# EAGLE design SMSM (EAGLE 7.3.0)
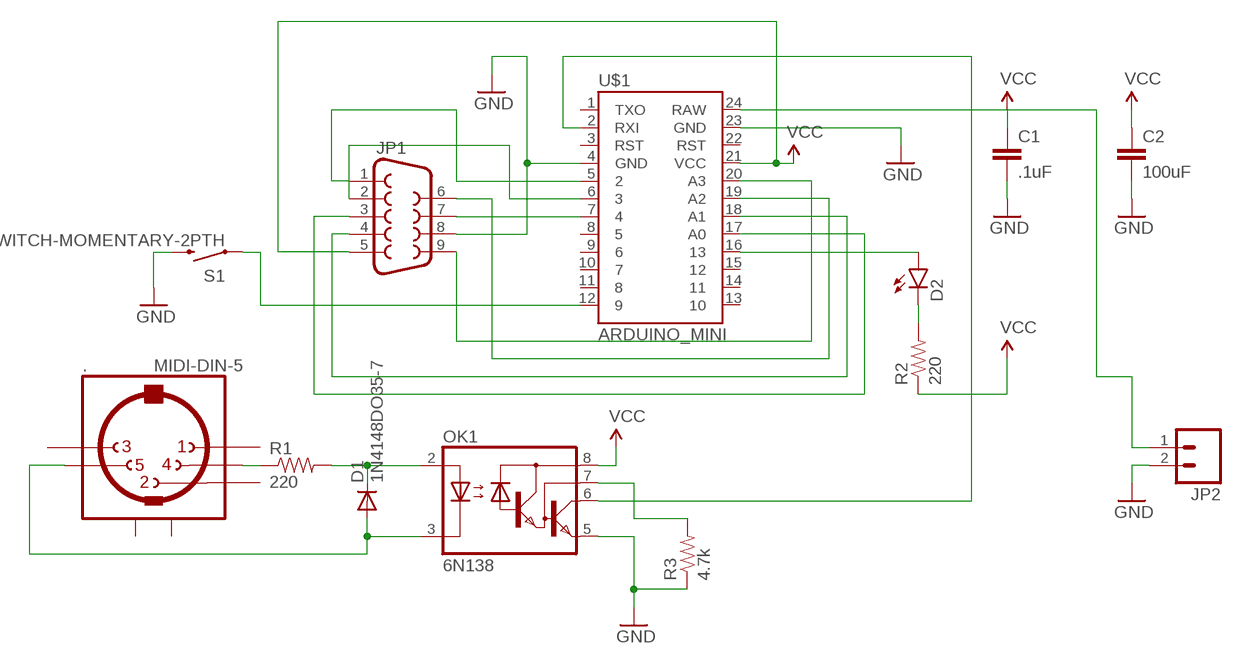
[diagram p0: schematic, sheet 1]

## Parts
.  MIDI-DIN-5  [MIDI-DIN-5]
C1  .1uF  CAPKIT  [CAP-PTH-SMALL-KIT]
C2  100uF  CAPKIT  [CAP-PTH-SMALL-KIT]
D1  1N4148DO35-7  [DO35-7]
D2  LED3MM  [LED3MM]
JP1  DB9FEMALE  [DB9]
JP2  M02LOCK_LONGPADS  [1X02_LOCK_LONGPADS]
OK1  6N138  [DIL08]
R1  220  10KOHM-1/4W5%(PTH)  [AXIAL-0.3]
R2  220  10KOHM-1/4W5%(PTH)  [AXIAL-0.3]
R3  4.7k  10KOHM-1/4W5%(PTH)  [AXIAL-0.3]
S1  SWITCH-MOMENTARY-2PTH  [TACTILE-PTH]
U$1  ARDUINO_MINI  [ARDUINO_MINI]

## Nets
GND: C1.2 C2.2 JP1.8 JP2.2 OK1.5(GND) R3.P$1 S1.3 U$1.4(GND) U$1.23(GND)
N$1: JP1.1 U$1.5
N$2: JP1.2 U$1.6
N$3: JP1.7 U$1.7
N$4: D2.A U$1.16
N$5: JP1.3 U$1.17(A0)
N$6: JP1.4 U$1.18(A1)
N$7: JP1.6 U$1.19(A2)
N$8: JP1.9 U$1.20(A3)
N$9: ..5 D1.A OK1.3(C)
N$10: D1.C OK1.2(A) R1.P$2
N$11: D2.K(C) R2.P$2
N$12: ..4 R1.P$1
N$13: OK1.7(VB) R3.P$2
N$14: OK1.6(VO) U$1.2(RXI)
N$15: S1.1 U$1.12
N$16: JP2.1 U$1.24(RAW)
VCC: C1.1 C2.1 JP1.5 OK1.8(VCC) R2.P$1 U$1.21(VCC)
Unconnected: ..1 ..2 ..3 ..PE1 ..PE2 ..PE11(PE1) ..PE22(PE2) U$1.1(TXO) U$1.3(RST) U$1.8 U$1.9 U$1.10 U$1.11 U$1.13 U$1.14 U$1.15 U$1.22(RST)

## Library data of the parts
. = MIDI by Jazz:MIDI-DIN-5
C1 C2 = SparkFun-Capacitors:CAP: Capacitor Standard 0603 ceramic capacitor, and 0.1" leaded capacitor.
D1 = diode:1N4148: DIODE high speed (Philips)
D2 = SparkFun-LED:LED: LEDs Standard schematic elements and footprints for 5mm, 3mm, 1206, and 0603 sized LEDs. 5mm - Spark Fun Electronics SKU : COM-00529 (and others)
JP1 = SparkFun-Connectors:DB9: DB9 Connector Standard DB9 (D-Sub 9) serial connector. Can be used for CAN bus as well as RS485 and RS232. Footprint production proven. Spark Fun Electronics SKU : PRT-00429; PROD_ID: CONN-08194
JP2 = SparkFun-Connectors:M02: Standard 2-pin 0.1" header. Use with - straight break away headers ( PRT-00116) - right angle break away headers (PRT-00553) - swiss pins (PRT-00743) - machine pins (PRT-00117) - female headers (PRT-00115) Molex polarized connector foot print use with: PRT-08233 with associated crimp pins and housings. 2.54_SCREWTERM for use with PRT-10571. 3.5mm Screw Terminal footprints for PRT-08084 5mm Screw Terminal footprints for use with PRT-08432
OK1 = optocoupler:6N138: MOTOROLA OPTO COUPLER; MF: VISHAY/TELEFUNKEN; MPN: 6N138; OC_FARNELL: 9860150; OC_NEWARK: 35K5294
R1-R3 = SparkFun-Resistors:10KOHM-1/4W5%(PTH): RES-09435; PROD_ID: RES-9435; VALUE: 10k
S1 = SparkFun-Electromechanical:SWITCH-MOMENTARY-2: Various NO switches- pushbuttons, reed, etc; PROD_ID: SWCH-08441
U$1 = SparkFun-Boards:ARDUINO_MINI: Arduino Pro Mini footprint

## Board
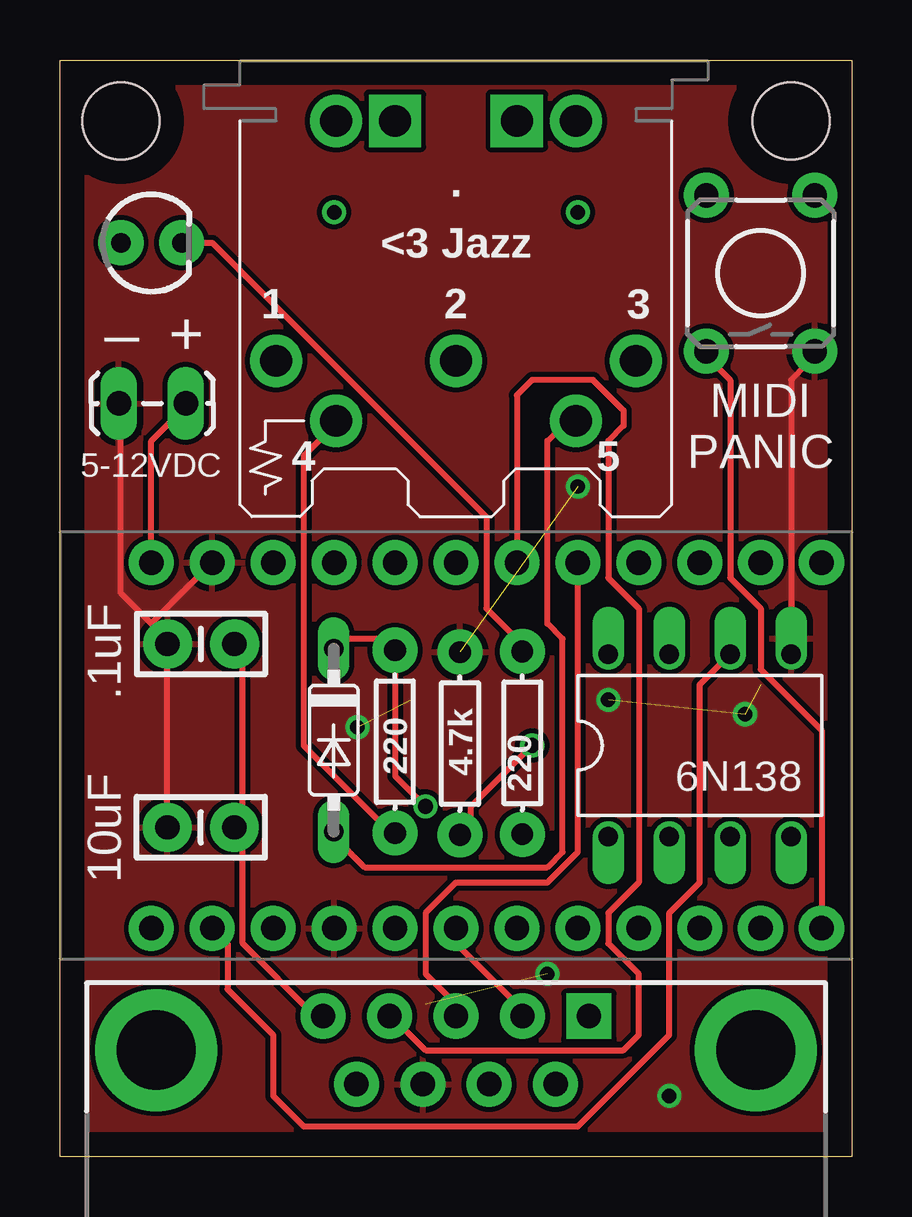
[diagram p1: board, top side]
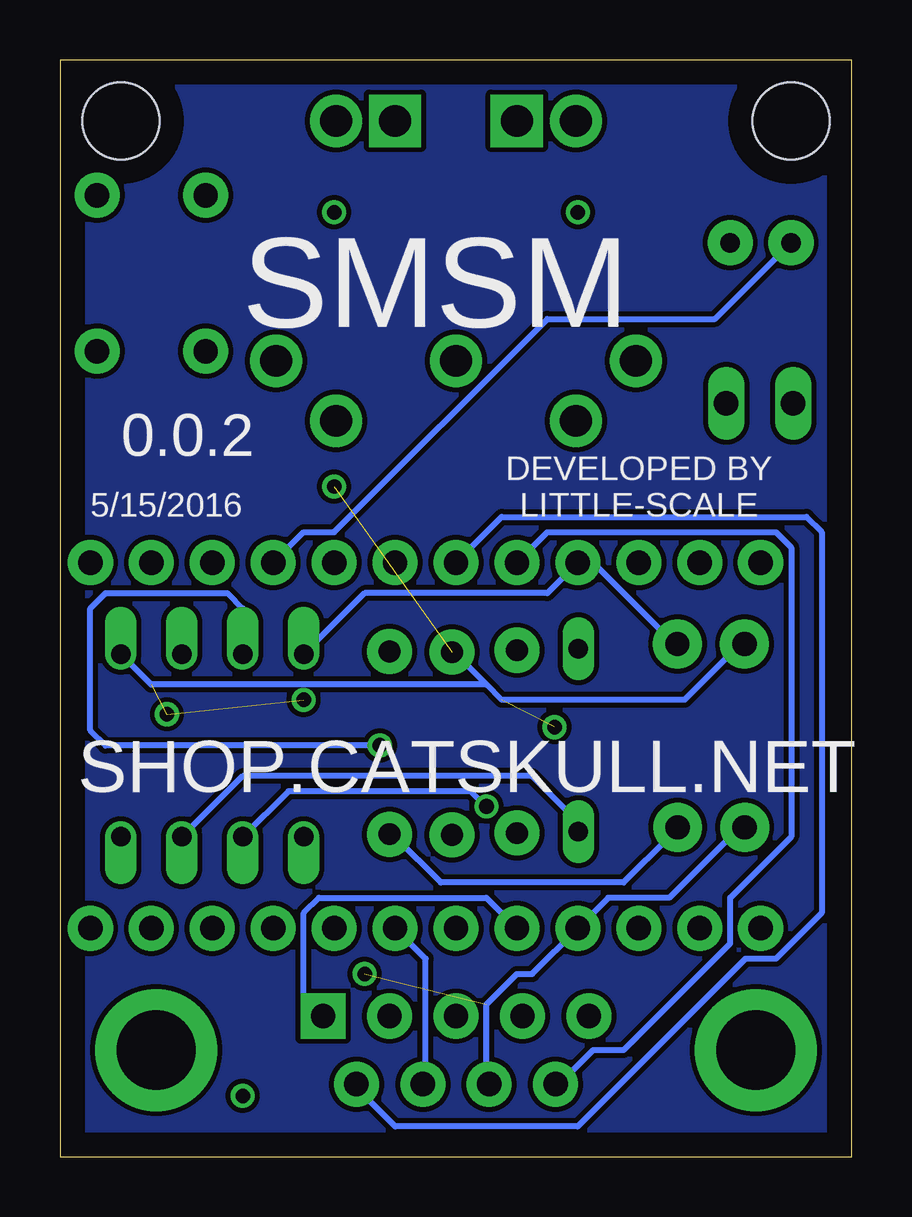
[diagram p2: board, bottom side, seen from below]

Size 33.02 x 45.72 mm. Coordinates in mm from the lower left corner, seen from the top.
Outline: 0,0 0,45.72 33.02,45.72 33.02,0 0,0
Copper layers (1*16): Top 0.035mm / dielectric 1.5mm / Bottom 0.035mm
Design rules "default": minimum track width 10mil, minimum drill 24mil, track to track 8mil, track to pad 8mil, pad to pad 8mil, via to via 8mil, smd to smd 8mil, copper to edge 40mil, drill to drill 8mil, minimum pad ring 10mil, minimum via ring 8mil, stop-mask expansion 4mil, vias tented up to drill 0mil, thermal gap 10mil
Holes 3.2 mm at 2.54,43.18 30.48,43.18

### Footprints (pad centres in the part's own frame; a part is rotated, then mirrored left to right if it is on the bottom)
MIDI-DIN-5 = drill 1.321 pad 2.184: 1 -7.5,-10; 2 0,-10; 3 7.5,-10; 4 -5,-12.5; 5 5,-12.5; PE1 5,0; PE2 -5,0 | drill 1.321 pad 2.184 square: PE11 2.54,0; PE22 -2.54,0
CAP-PTH-SMALL-KIT = drill 1.016 pad 2.032: 1 -1.397,0; 2 1.397,0
DO35-7 = drill 0.813 long: A 3.81,0; C -3.81,0
LED3MM = drill 0.813 pad 1.88: A -1.27,0; K 1.27,0
DB9 = drill 1.016 pad 1.88 square: 1 -5.54,-1.42 | drill 1.016 pad 1.88: 2 -2.77,-1.42; 3 0,-1.42; 4 2.77,-1.42; 5 5.54,-1.42; 6 -4.15,1.42; 7 -1.38,1.42; 8 1.38,1.42; 9 4.15,1.42 | drill 3.302 pad 5.08: G1 -12.5,0; G2 12.5,0
1X02_LOCK_LONGPADS = drill 1.016 long: 1 -0.127,0; 2 2.667,0
DIL08 = drill 0.813 offset: 1 -3.81,-3.81; 2 -1.27,-3.81; 3 1.27,-3.81; 4 3.81,-3.81; 5 3.81,3.81; 6 1.27,3.81; 7 -1.27,3.81; 8 -3.81,3.81
AXIAL-0.3 = drill 0.9 pad 1.88: P$1 -3.81,0; P$2 3.81,0
TACTILE-PTH = drill 1.016 pad 1.88: 1 -3.251,2.261; 2 3.251,2.261; 3 -3.251,-2.261; 4 3.251,-2.261
ARDUINO_MINI = drill 1.016 pad 1.88: 1 -7.62,12.7; 2 -7.62,10.16; 3 -7.62,7.62; 4 -7.62,5.08; 5 -7.62,2.54; 6 -7.62,0; 7 -7.62,-2.54; 8 -7.62,-5.08; 9 -7.62,-7.62; 10 -7.62,-10.16; 11 -7.62,-12.7; 12 -7.62,-15.24; 13 7.62,-15.24; 14 7.62,-12.7; 15 7.62,-10.16; 16 7.62,-7.62; 17 7.62,-5.08; 18 7.62,-2.54; 19 7.62,0; 20 7.62,2.54; 21 7.62,5.08; 22 7.62,7.62; 23 7.62,10.16; 24 7.62,12.7

### Placement (x,y rotation side)
.  16.51,43.18 0 top
C1  5.87,13.73 180 top
C2  5.88,21.38 180 top
D1  11.41,17.37 270 top
D2  3.81,38.1 0 top
JP1  16.51,4.45 180 top
JP2  5.12,31.4 180 top
OK1  26.67,17.14 0 top
R1  13.97,17.3 90 top
R2  19.28,17.25 90 top
R3  16.68,17.23 270 top
S1  29.21,36.83 90 top
U$1  16.51,17.14 90 top

### Tracks (layer width: path | path; a pad name or v marks a point on that pad's centre or on a via)
GND  (via drill 0.6)  (5 unrouted)
  Top 0.254: OK1.5 30.48,32.38 31.11,33.02 S1.3 | 3.81,22.22 4.45,21.59 C2.2 4.45,20.95 4.45,13.97 C1.2 | 3.81,22.22 2.54,23.5 2.54,31.11 JP2.2 | 3.81,22.22 U$1.23
  Bottom 0.254: C1.2 5.08,13.33 7.62,10.79 10.16,10.79 U$1.4 13.34,7.62 13.97,7.62 15.24,6.35 15.24,3.17 JP1.8 | 15.24,19.68 14.61,19.05 6.99,19.05 5.08,20.95 C2.2 | 15.24,19.68 16.51,20.95 R3.P$1 | OK1.5 29.21,19.68 15.24,19.68
  other vias: 25.4,2.54 28.56,18.45 20.32,7.62 12.4,17.91 21.59,27.94 22.86,19.05
  pour Top: 0,45.72 33.02,45.72 33.02,0 0,0
N$1
  Bottom 0.254: U$1.5 15.24,10.79 22.23,10.79 22.86,10.16 22.86,6.35 22.23,6.35 JP1.1
N$2
  Top 0.254: U$1.6 16.51,8.89 19.05,6.35 JP1.2
N$3
  Bottom 0.254: JP1.7 17.78,3.17 17.78,8.26 U$1.7
N$4
  Bottom 0.254: D2.A 5.71,34.93 12.7,34.93 21.59,26.04 22.86,26.04 U$1.16
N$5
  Top 0.254: JP1.3 16.51,6.35 15.24,7.62 15.24,10.16 16.51,11.43 20.32,11.43 21.59,12.7 U$1.17
N$6
  Top 0.254: JP1.4 13.97,5.71 15.24,4.45 23.5,4.45 24.13,5.08 24.13,7.62 22.86,8.89 22.86,10.16 24.13,11.43 24.13,22.86 22.86,24.13 22.86,29.84 23.5,30.48 23.5,31.11 22.23,32.38 19.68,32.38 19.05,31.75 U$1.18
N$7
  Bottom 0.254: U$1.19 14.61,26.67 1.91,26.67 1.27,26.04 1.27,10.16 3.17,8.26 4.45,8.26 11.43,1.27 19.05,1.27 20.32,2.54 JP1.6
N$8
  Bottom 0.254: U$1.20 12.7,26.04 3.17,26.04 2.54,25.4 2.54,13.33 5.08,10.79 5.08,8.89 9.53,4.45 10.79,4.45 12.06,3.17 JP1.9
N$9
  Top 0.254: ..5 20.95,30.48 20.32,29.84 20.32,22.22 20.95,21.59 20.95,12.7 20.32,12.06 12.7,12.06 11.43,13.33 D1.A
  Bottom 0.254: OK1.3 25.4,15.88 13.34,15.88 11.43,13.97 D1.A
N$10  (via drill 0.61)
  Top 0.254: v15.24,14.61 13.97,15.88 13.97,20.95 R1.P$2 13.34,21.59 11.43,21.59 D1.C
  Bottom 0.254: OK1.2 23.5,15.24 15.88,15.24 v15.24,14.61
N$11
  Top 0.254: D2.K 6.35,38.1 17.78,26.67 17.78,22.86 19.05,21.59 R2.P$2
N$12
  Top 0.254: R1.P$1 13.34,13.97 10.16,17.14 10.16,29.21 11.43,30.48 ..4
N$13  (via drill 0.61)
  Top 0.254: v19.68,17.14 17.14,14.61 17.14,13.97 R3.P$2
  Bottom 0.254: OK1.7 25.4,22.86 26.04,23.5 31.11,23.5 31.75,22.86 31.75,17.78 31.11,17.14 v19.68,17.14
N$14
  Top 0.254: OK1.6 26.67,19.68 26.67,11.43 25.4,10.16 25.4,5.08 21.59,1.27 10.16,1.27 8.89,2.54 8.89,5.08 6.99,6.98 6.99,8.89 U$1.2
N$15
  Top 0.254: U$1.12 31.75,17.78 29.21,20.32 29.21,22.86 27.94,24.13 27.94,32.38 27.3,33.02 S1.1
N$16
  Top 0.254: U$1.24 3.81,29.84 5.08,31.11 JP2.1
N$17
  pour Bottom: 0,45.72 33.02,45.72 33.02,0 0,0
N$19  (via drill 0.6)
  other vias: 21.59,39.37
N$20  (via drill 0.6)
  other vias: 11.43,39.37
VCC
  Top 0.254: 7.62,13.33 C1.1 | C2.1 7.62,20.95 7.62,13.97 C1.1 | JP1.5 10.64,5.87 7.62,8.89 7.62,13.38 C1.1
  Bottom 0.254: OK1.8 20.32,23.5 12.7,23.5 U$1.21 10.79,24.77 7.62,21.59 C2.1 | R2.P$1 19.05,13.33 17.14,11.43 9.53,11.43 7.62,13.33 C1.1

### Text on the board
tNames: _ | + | MIDI / PANIC | 5-12VDC | .1uF | 10uF
bNames: SMSM | 0.0.2 | DEVELOPED BY / LITTLE-SCALE | 5/15/2016 | SHOP.CATSKULL.NET